# Altium schematic sheet LogicAnalyser.SchDoc
size A; Organization: Altium Limited; Address1: L3, 12a Rodborough Rd; Address2: Frenchs Forest; Address3: NSW; Address4: Australia 2086; DocumentNumber: 6; SheetNumber: 6; SheetTotal: 6
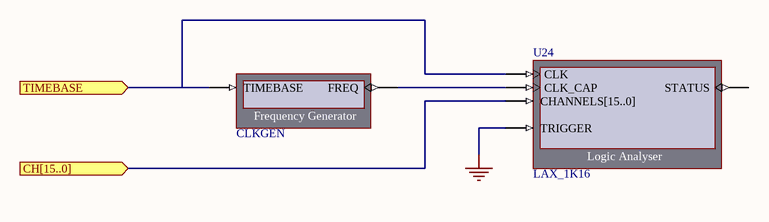
[diagram p0: LogicAnalyser.SchDoc]

## Parts
CLK_CAP1  CLKGEN
U24  LAX_1K16

## Ports
CH[15..0] (in), TIMEBASE (in)

## Nets
GND: U24.TRIGGER
CH[15..0]: U24.CHANNELS[15..0] ; port CH[15..0]
TIMEBASE: CLK_CAP1.TIMEBASE U24.CLK ; port TIMEBASE
NetCLK_CAP1_FREQ: CLK_CAP1.FREQ U24.CLK_CAP

Not connected (* = marked no-connect by the designer): U24 STATUS

## Notes on the sheet
- Title
- Size:
- Date:
- A
- Number:
- Time:
- Revision:
- Sheet
- of
- File:
- (in symbol LAX_1K16) Logic Analyser

## Library data of the parts
CLK_CAP1 = CLKGEN: Frequency Generator; NEXUS_CORE: Instrument; NEXUS_JTAG_DEVICE: True; NEXUS_JTAG_ORDER: 10; Published: 30/09/2003; Publisher: Altium Hobart Technology Centre; Core Revision: 1.00.00
U24 = LAX_1K16: Logic Analyser 1K16; NEXUS_CORE: Instrument; NEXUS_JTAG_DEVICE: True; NEXUS_JTAG_ORDER: 0; ChildModel1: RAM1KX16_LA16_1K; Published: 24/11/2003; Publisher: Altium Hobart Technology Centre; Core Revision: 1.00.00